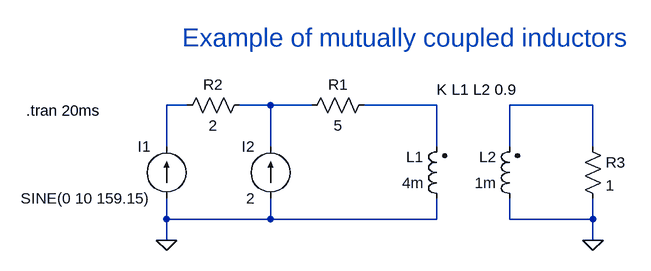
[diagram p0: schematic Example-of-mutually-coupled-inductors.asc]
Example-of-mutually-coupled-inductors.asc, the LTspice schematic file:
Version 4.1
SHEET 1 880 680
WIRE -128 64 -160 64
WIRE 0 64 -48 64
WIRE 64 64 0 64
WIRE 256 64 144 64
WIRE 496 64 368 64
WIRE -160 128 -160 64
WIRE 0 128 0 64
WIRE 256 128 256 64
WIRE 368 128 368 64
WIRE 496 128 496 64
WIRE -160 240 -160 208
WIRE 0 240 0 208
WIRE 0 240 -160 240
WIRE 256 240 256 208
WIRE 256 240 0 240
WIRE 368 240 368 208
WIRE 496 240 496 208
WIRE 496 240 368 240
WIRE -160 272 -160 240
WIRE 496 272 496 240
FLAG -160 272 0
FLAG 496 272 0
SYMBOL ind2 272 224 R180
WINDOW 0 36 80 Left 2
WINDOW 3 36 40 Left 2
SYMATTR InstName L1
SYMATTR Value 4m
SYMATTR Type ind
SYMBOL ind2 384 224 R180
WINDOW 0 36 80 Left 2
WINDOW 3 36 40 Left 2
SYMATTR InstName L2
SYMATTR Value 1m
SYMATTR Type ind
SYMBOL res 48 80 R270
WINDOW 0 32 56 VTop 2
WINDOW 3 0 56 VBottom 2
SYMATTR InstName R1
SYMATTR Value 5
SYMBOL res -144 80 R270
WINDOW 0 32 56 VTop 2
WINDOW 3 0 56 VBottom 2
SYMATTR InstName R2
SYMATTR Value 2
SYMBOL current -160 208 R180
WINDOW 0 24 80 Left 2
WINDOW 3 24 0 Left 2
WINDOW 123 0 0 Left 2
WINDOW 39 0 0 Left 2
SYMATTR InstName I1
SYMATTR Value SINE(0 10 159.15)
SYMBOL current 0 208 R180
WINDOW 0 24 80 Left 2
WINDOW 3 24 0 Left 2
WINDOW 123 0 0 Left 2
WINDOW 39 0 0 Left 2
SYMATTR InstName I2
SYMATTR Value 2
SYMBOL res 480 112 R0
SYMATTR InstName R3
SYMATTR Value 1
TEXT -376 72 Left 2 !.tran 20ms
TEXT 256 40 Left 2 !K L1 L2 0.9
TEXT -136 -40 Left 4 ;Example of mutually coupled inductors

The netlist it stands for:
* Example-of-mutually-coupled-inductors.asc
L1 0 N003 4m
L2 0 N004 1m
R1 N002 N003 5
R2 N001 N002 2
I1 0 N001 SINE(0 10 159.15)
I2 0 N002 2
R3 N004 0 1
.tran 20ms
K L1 L2 0.9
* Example of mutually coupled inductors
.backanno
.end